# Altium schematic sheet passive_balancing.SchDoc: foxBMS BMS-Slave 12-Cell
size A3; DocumentNumber: 9; SheetNumber: 9; SheetTotal: 21; AUTHOR: Fraunhofer IISB foxBMS Team; SheetDescription: Passive Cell Balancing
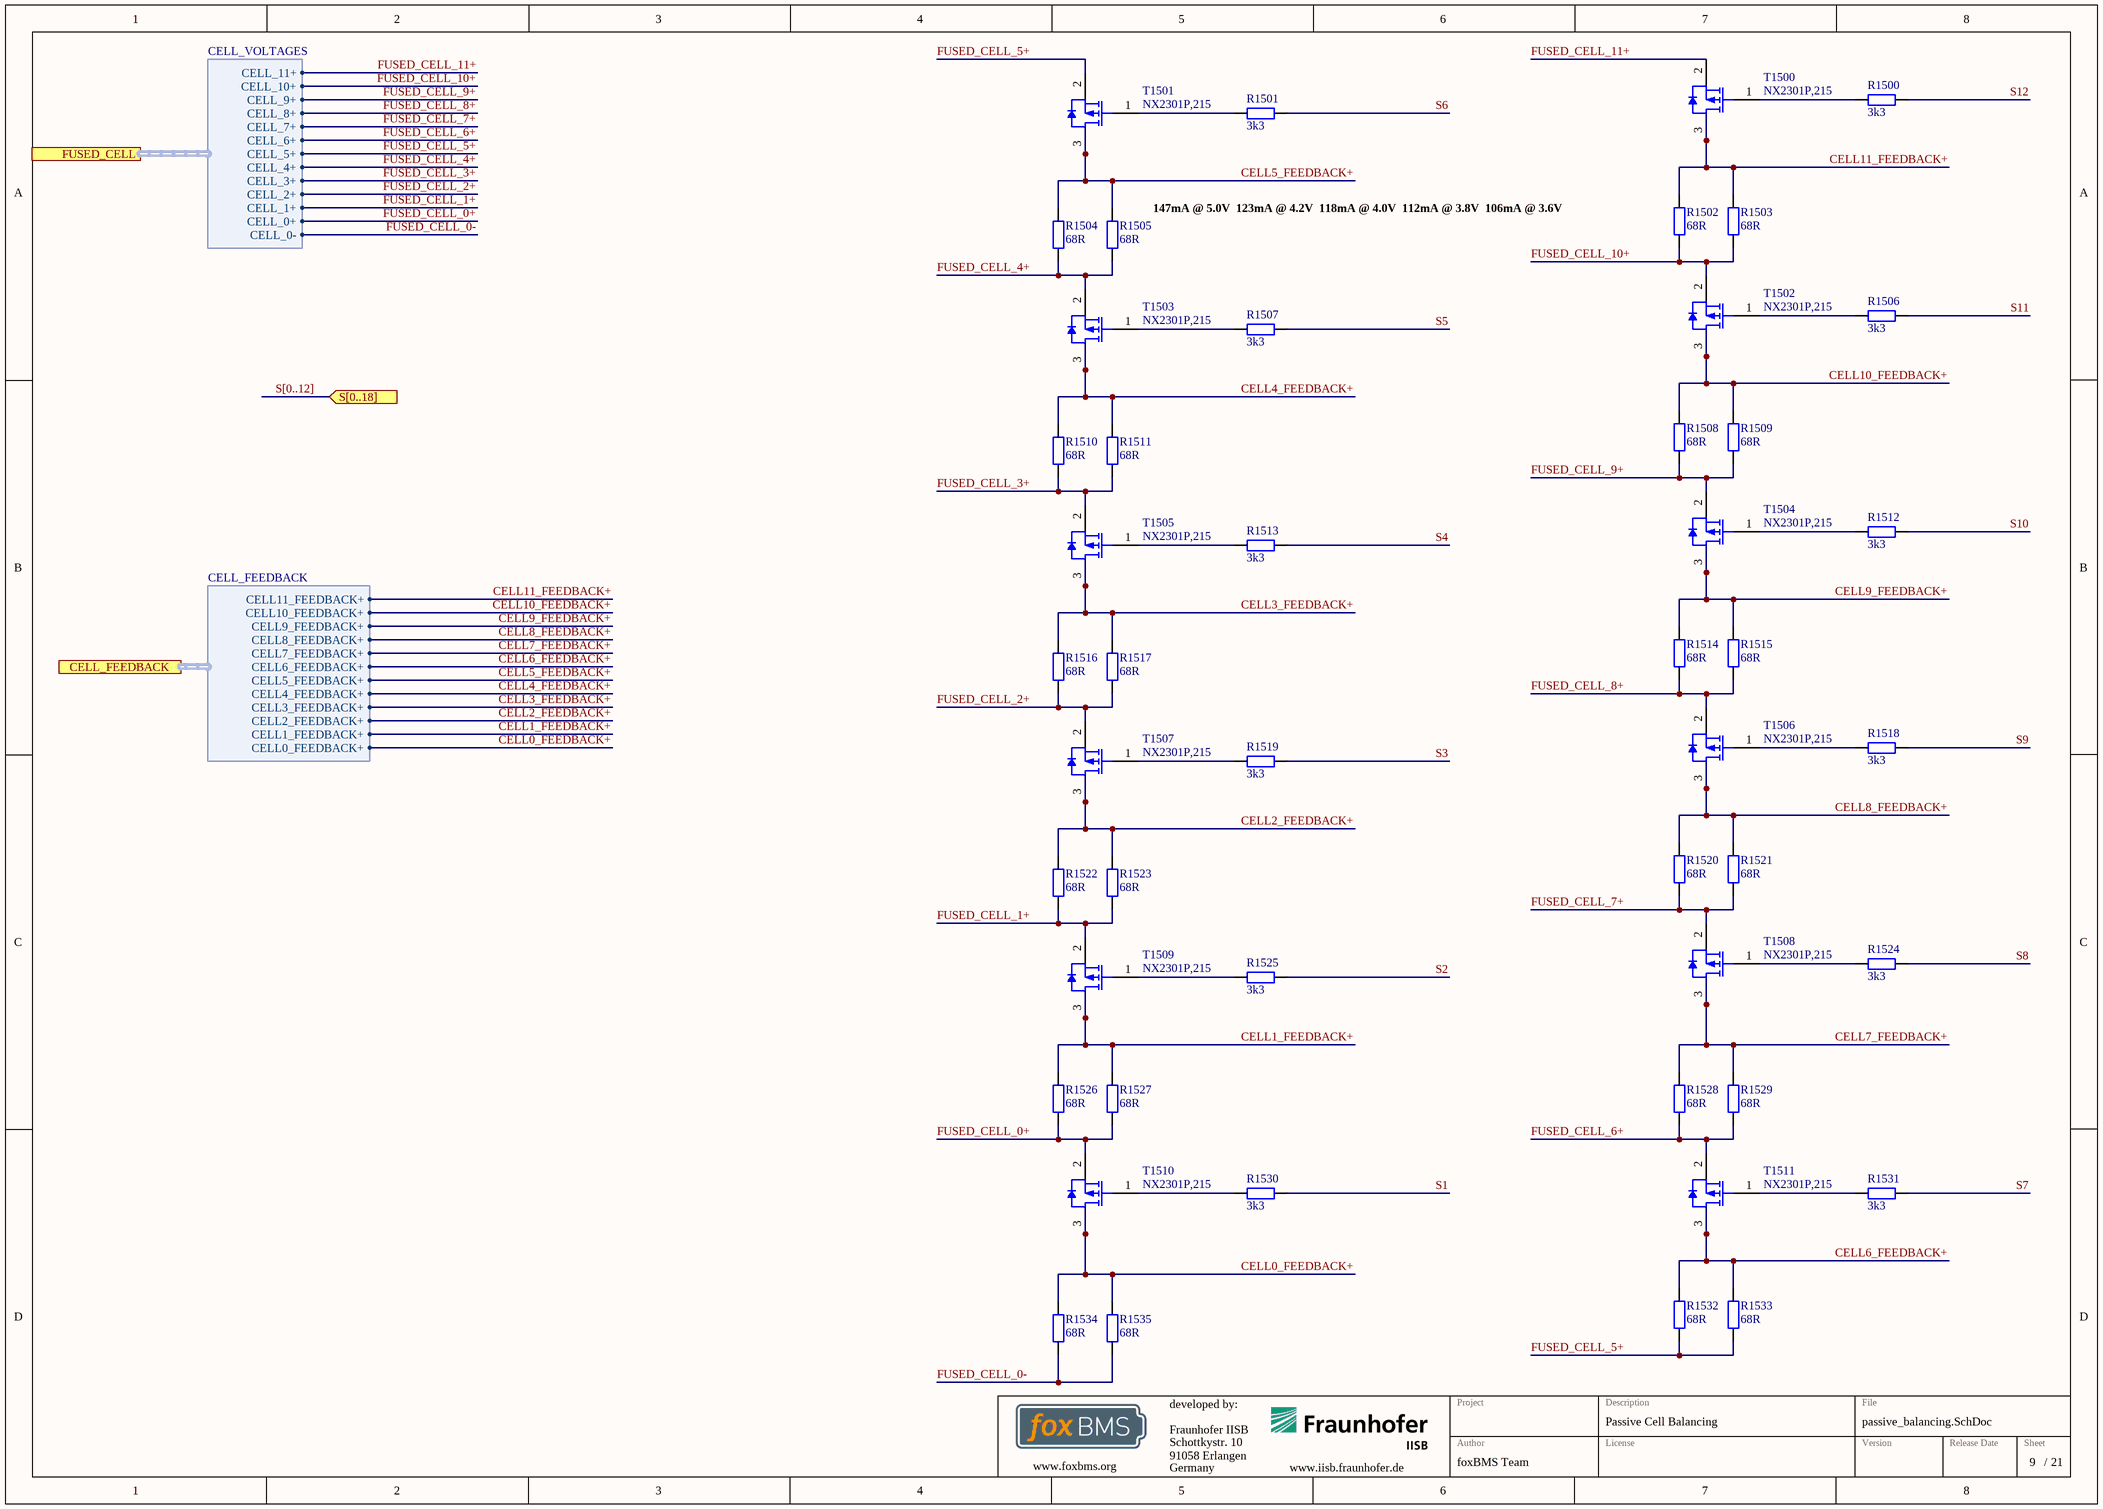
[diagram p0: passive_balancing.SchDoc]

## Parts
R1500  3k3  [RESC1608X05N]
R1501  3k3  [RESC1608X05N]
R1502  68R  [RESC5025X07N]
R1503  68R  [RESC5025X07N]
R1504  68R  [RESC5025X07N]
R1505  68R  [RESC5025X07N]
R1506  3k3  [RESC1608X05N]
R1507  3k3  [RESC1608X05N]
R1508  68R  [RESC5025X07N]
R1509  68R  [RESC5025X07N]
R1510  68R  [RESC5025X07N]
R1511  68R  [RESC5025X07N]
R1512  3k3  [RESC1608X05N]
R1513  3k3  [RESC1608X05N]
R1514  68R  [RESC5025X07N]
R1515  68R  [RESC5025X07N]
R1516  68R  [RESC5025X07N]
R1517  68R  [RESC5025X07N]
R1518  3k3  [RESC1608X05N]
R1519  3k3  [RESC1608X05N]
R1520  68R  [RESC5025X07N]
R1521  68R  [RESC5025X07N]
R1522  68R  [RESC5025X07N]
R1523  68R  [RESC5025X07N]
R1524  3k3  [RESC1608X05N]
R1525  3k3  [RESC1608X05N]
R1526  68R  [RESC5025X07N]
R1527  68R  [RESC5025X07N]
R1528  68R  [RESC5025X07N]
R1529  68R  [RESC5025X07N]
R1530  3k3  [RESC1608X05N]
R1531  3k3  [RESC1608X05N]
R1532  68R  [RESC5025X07N]
R1533  68R  [RESC5025X07N]
R1534  68R  [RESC5025X07N]
R1535  68R  [RESC5025X07N]
T1500  NX2301P,215  [NXP-SOT23_N]
T1501  NX2301P,215  [NXP-SOT23_N]
T1502  NX2301P,215  [NXP-SOT23_N]
T1503  NX2301P,215  [NXP-SOT23_N]
T1504  NX2301P,215  [NXP-SOT23_N]
T1505  NX2301P,215  [NXP-SOT23_N]
T1506  NX2301P,215  [NXP-SOT23_N]
T1507  NX2301P,215  [NXP-SOT23_N]
T1508  NX2301P,215  [NXP-SOT23_N]
T1509  NX2301P,215  [NXP-SOT23_N]
T1510  NX2301P,215  [NXP-SOT23_N]
T1511  NX2301P,215  [NXP-SOT23_N]

## Ports
CELL_FEEDBACK (harness CELL_FEEDBACK), FUSED_CELL (harness CELL_VOLTAGES), S[0..18] (in)

## Harnesses
CELL_VOLTAGES: CELL_0-, CELL_0+, CELL_1+, CELL_10+, CELL_11+, CELL_2+, CELL_3+, CELL_4+, CELL_5+, CELL_6+, CELL_7+, CELL_8+, CELL_9+
CELL_FEEDBACK: CELL11_FEEDBACK+, CELL10_FEEDBACK+, CELL9_FEEDBACK+, CELL8_FEEDBACK+, CELL7_FEEDBACK+, CELL6_FEEDBACK+, CELL5_FEEDBACK+, CELL4_FEEDBACK+, CELL3_FEEDBACK+, CELL2_FEEDBACK+, CELL1_FEEDBACK+, CELL0_FEEDBACK+

## Nets
CELL0_FEEDBACK+: R1534.2 R1535.2 T1510.3(D) ; port CELL_FEEDBACK.CELL0_FEEDBACK+
CELL1_FEEDBACK+: R1526.2 R1527.2 T1509.3(D) ; port CELL_FEEDBACK.CELL1_FEEDBACK+
CELL2_FEEDBACK+: R1522.2 R1523.2 T1507.3(D) ; port CELL_FEEDBACK.CELL2_FEEDBACK+
CELL3_FEEDBACK+: R1516.2 R1517.2 T1505.3(D) ; port CELL_FEEDBACK.CELL3_FEEDBACK+
CELL4_FEEDBACK+: R1510.2 R1511.2 T1503.3(D) ; port CELL_FEEDBACK.CELL4_FEEDBACK+
CELL5_FEEDBACK+: R1504.2 R1505.2 T1501.3(D) ; port CELL_FEEDBACK.CELL5_FEEDBACK+
CELL6_FEEDBACK+: R1532.2 R1533.2 T1511.3(D) ; port CELL_FEEDBACK.CELL6_FEEDBACK+
CELL7_FEEDBACK+: R1528.2 R1529.2 T1508.3(D) ; port CELL_FEEDBACK.CELL7_FEEDBACK+
CELL8_FEEDBACK+: R1520.2 R1521.2 T1506.3(D) ; port CELL_FEEDBACK.CELL8_FEEDBACK+
CELL9_FEEDBACK+: R1514.2 R1515.2 T1504.3(D) ; port CELL_FEEDBACK.CELL9_FEEDBACK+
CELL10_FEEDBACK+: R1508.2 R1509.2 T1502.3(D) ; port CELL_FEEDBACK.CELL10_FEEDBACK+
CELL11_FEEDBACK+: R1502.2 R1503.2 T1500.3(D) ; port CELL_FEEDBACK.CELL11_FEEDBACK+
FUSED_CELL_0+: R1526.1 R1527.1 T1510.2(S) ; port FUSED_CELL.CELL_0+
FUSED_CELL_0-: R1534.1 R1535.1 ; port FUSED_CELL.CELL_0-
FUSED_CELL_1+: R1522.1 R1523.1 T1509.2(S) ; port FUSED_CELL.CELL_1+
FUSED_CELL_2+: R1516.1 R1517.1 T1507.2(S) ; port FUSED_CELL.CELL_2+
FUSED_CELL_3+: R1510.1 R1511.1 T1505.2(S) ; port FUSED_CELL.CELL_3+
FUSED_CELL_4+: R1504.1 R1505.1 T1503.2(S) ; port FUSED_CELL.CELL_4+
FUSED_CELL_5+: R1532.1 R1533.1 T1501.2(S) ; port FUSED_CELL.CELL_5+
FUSED_CELL_6+: R1528.1 R1529.1 T1511.2(S) ; port FUSED_CELL.CELL_6+
FUSED_CELL_7+: R1520.1 R1521.1 T1508.2(S) ; port FUSED_CELL.CELL_7+
FUSED_CELL_8+: R1514.1 R1515.1 T1506.2(S) ; port FUSED_CELL.CELL_8+
FUSED_CELL_9+: R1508.1 R1509.1 T1504.2(S) ; port FUSED_CELL.CELL_9+
FUSED_CELL_10+: R1502.1 R1503.1 T1502.2(S) ; port FUSED_CELL.CELL_10+
FUSED_CELL_11+: T1500.2(S) ; port FUSED_CELL.CELL_11+
S1: R1530.2
S2: R1525.2
S3: R1519.2
S4: R1513.2
S5: R1507.2
S6: R1501.2
S7: R1531.2
S8: R1524.2
S9: R1518.2
S10: R1512.2
S11: R1506.2
S12: R1500.2
NetR1500_1: R1500.1 T1500.1(G)
NetR1501_1: R1501.1 T1501.1(G)
NetR1506_1: R1506.1 T1502.1(G)
NetR1507_1: R1507.1 T1503.1(G)
NetR1512_1: R1512.1 T1504.1(G)
NetR1513_1: R1513.1 T1505.1(G)
NetR1518_1: R1518.1 T1506.1(G)
NetR1519_1: R1519.1 T1507.1(G)
NetR1524_1: R1524.1 T1508.1(G)
NetR1525_1: R1525.1 T1509.1(G)
NetR1530_1: R1530.1 T1510.1(G)
NetR1531_1: R1531.1 T1511.1(G)

## Buses and harness runs
bus S[0..12] = port S[0..18]

## Notes on the sheet
- (near R1505) 147mA @ 5.0V
  123mA @ 4.2V
  118mA @ 4.0V
  112mA @ 3.8V
  106mA @ 3.6V
- Fraunhofer IISB
- Schottkystr. 10
- developed by:
- 91058 Erlangen
- Germany
- Author
- Project
- License
- Description
- File
- Version
- Release Date
- Sheet
- www.foxbms.org
- www.iisb.fraunhofer.de
- foxBMS Team
- /

## Library data of the parts
R1500 R1501 R1506 R1507 R1512 R1513 R1518 R1519 R1524 R1525 R1530 R1531 = gen_R_3k3_0603: SMD Resistor 3k3 0603; Tolerance: 1%; Power: 0.1W; Case EIA: 0603; Case Metric: 1608; Maximum Working Voltage: 75V; PnP Package: R_0603; Automotive Qualified: False; Part Number: gen_R_3k3_0603; Operating Temperature: -55°C - +155°C; Resistance: 3k3; Series: E24; PnP Value: 3k3; Supplier 1: Farnell; Supplier Part Number 1: 1469793
R1502-R1505 R1508-R1511 R1514-R1517 R1520-R1523 R1526-R1529 R1532-R1535 = gen_R_68R_2010: SMD Resistor 68R 2010; Tolerance: 1%; Power: 0.75W; Case EIA: 2010; Case Metric: 5025; Maximum Working Voltage: 200V; PnP Package: R_2010; Automotive Qualified: False; Part Number: gen_R_68R_2010; Operating Temperature: -55°C - +155°C; Resistance: 68R; Series: E24; PnP Value: 68R; Supplier 1: Farnell; Supplier Part Number 1: 2323988
T1500-T1511 = CMP-1259-00090-1: P-Channel Trench MOSFET, -20 V, -2 A, -55 to 150 degC, 3-Pin SOT23, Tape and Reel; Manufacturer: NXP Semiconductors; VGSth [typ] (V): -0.75; Channel Type: P; Packing: Tape & Reel; Automotive Qualified: Y; IDM [max] (A): -6; PackageReference: SOT23; PartNumber: NX2301P,215; PackageVersion: 06-03-16, 03/2006; ComponentLink1URL: http://www.nxp.com/; ID [max] (A): -2; Mounting Technology: Surface Mount; ComponentLink1Description: Manufacturer URL; VDS [max] (V): -20; Code_JEDEC: TO-236AB; DatasheetVersion: Rev. 1; ComponentLink3URL: http://www.nxp.com/documents/outline_drawing/sot023_po.pdf; ComponentLink2Description: Datasheet; PackageDescription: 3-Pin Small Outline Transistor Package, Body 2.9 x 1.3 mm, Pitch 0.95 mm; ComponentLink3Description: Package Specification; ComponentLink2URL: http://www.nxp.com/documents/data_sheet/NX2301P.pdf